# Altium schematic sheet Power.SchDoc
size A4; SheetNumber: 3; SheetTotal: 7
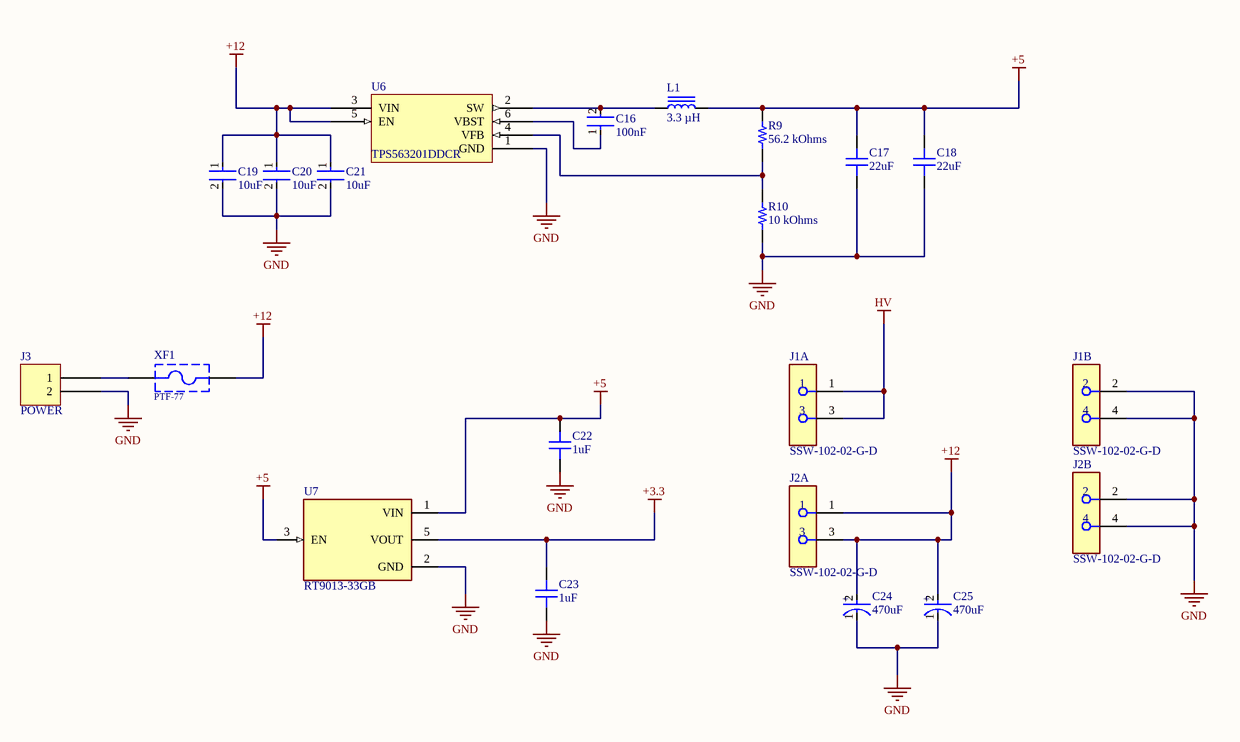
[diagram p0: Power.SchDoc]

## Parts
C16  100nF  [FP-C1005-050-0_15-MFG]
C17  22uF  [CAP 0603_1608]
C18  22uF  [CAP 0603_1608]
C19  10uF  [FP-CL21-IPC_B]
C20  10uF  [FP-CL21-IPC_B]
C21  10uF  [FP-CL21-IPC_B]
C22  1uF  [CAP 0603_1608]
C23  1uF  [CAP 0603_1608]
C24  470uF  [FP-RAD-TH-D_8_0_5-L_15_1-MFG]
C25  470uF  [FP-RAD-TH-D_8_0_5-L_15_1-MFG]
J1  SSW-102-02-G-D  [FP-SSW-102-02-G-D-MFG]  (parts A,B of 2)
J2  SSW-102-02-G-D  [FP-SSW-102-02-G-D-MFG]  (parts A,B of 2)
J3  POWER  [MOLEX KK 0022272021]
L1  3.3 µH  [BOURNS SRP5030T]
R9  56.2 kOhms  [RES 0402_1005]
R10  10 kOhms  [RES 0402_1005]
U6  TPS563201DDCR  [SOT23-6_M]
U7  RT9013-33GB  [RT9013]
XF1  PTF-77  [696107003002]

## Nets
+3.3: C23.2 U7.5(VOUT)
+5: C17.2 C18.2 C22.2 L1.2 R9.2 U7.1(VIN) U7.3(EN)
+12: C19.1 C20.1 C21.1 C24.2(A) C25.2(A) J2.1 J2.3 U6.3(VIN) U6.5(EN) XF1.2
GND: C17.1 C18.1 C19.2 C20.2 C21.2 C22.1 C23.1 C24.1(C) C25.1(C) J1.2 J1.4 J2.2 J2.4 J3.2 R10.1 U6.1(GND) U7.2(GND)
HV: J1.1 J1.3
NetC16_1: C16.1 U6.6(VBST)
NetC16_2: C16.2 L1.1 U6.2(SW)
NetJ3_1: J3.1 XF1.1
NetR9_1: R9.1 R10.2 U6.4(VFB)

## Notes on the sheet
- (in symbol CMP-05427-000701-1) +

## Library data of the parts
C16 = CMP-2000-05438-2: CAP CER 100nF 10V X5R 0402; Dielectric Material: Ceramic; Tolerance: 20%; Capacitance: 4.7uF; RoHS Compliant: Yes; Lead Free: Lead Free; Max Operating Temperature: 85°C; Case Code (Metric): 1005; Dielectric: X5R; Height: 0.5mm; Length: 1mm; Case Code (Imperial): 0402; Width: 0.02inch; Mount: Surface Mount; Case/Package: 0402; Min Operating Temperature: -55°C; Radiation Hardening: No; Resistor Type: Ceramic; Construction: Flat; REACH SVHC: No SVHC; Voltage Rating (DC): 10V; Voltage Rating: 10V; Package Quantity: 1; Termination: SMD/SMT; Thickness: 500um; Voltage: 10V; Packaging: Tape and Reel; Depth: 0.5mm; Weight: 2.3E-05oz; Series: C
C17 C18 C22 C23 = C0603C272F3GAC7867: CL10A226MP8NUNE; manufacturer: KEMET; Temperature Coefficient: C0G, NP0; Tolerance: ±1%; Voltage - Rated: 25V; Part Number: C0603C272F3GAC7867; Applications: General Purpose; componentlink1description: Datasheet; componentlink1url: https://api.kemet.com/component-edge/download/datasheet/C0603C272F3GACTU.pdf; componentlink2description: DigiKey Link; componentlink2url: https://www.digikey.com/en/products/detail/kemet/C0603C272F3GAC7867/2200413; Device Package: 0603 (1608 Metric); Features: Low ESL; lastupdated: 22.03.2023 19:09:03; Lifecycle Status: Active; Minimum Order: 1; Mounting Type: Surface Mount, MLCC; Operating Temperature: -55°C ~ 125°C; Package / Case: 0603 (1608 Metric); packaging: TapeAndReel; partid: 2138; Part Status: Active; price: 0.42; series: SMD Comm C0G; Size / Dimension: 0.063" L x 0.031" W (1.60mm x 0.80mm); Supplier 1: DigiKey; Supplier Part Number 1: 399-17403-1-ND; Thickness (Max): 0.034" (0.87mm)
  C17 C18: Value: 22uF; Capacitance: 22uF
  C22 C23: Value: 1uF; Capacitance: 1uF
C19-C21 = CMP-2000-06102-2: CL21 Series 0805 10uF 16V ±10% Tolerance X5R Multilayer Ceramic Chip Capacitor; Dielectric: X7R; Length: 2mm; Depth: 1.25mm; Voltage: 16V; Width: 0.049inch; Capacitance: 10uF; Lead Free: Lead Free; Max Operating Temperature: 85°C; Mount: Surface Mount; Voltage Rating: 16V; Height: 1.25mm; Radiation Hardening: No; Packaging: Tape and Reel; Voltage Rating (DC): 16V; Thickness: 0.055inch; Case/Package: 0805; Case Code (Imperial): 0805; Min Operating Temperature: -55°C; Case Code (Metric): 2012; Package Quantity: 1; Tolerance: 10%
C24 C25 = CMP-05427-000701-1: EEUFM1C471L; Ripple Current: 1.14A; Lead Diameter: 0.6mm; Voltage Rating: 50V; Polarity: Polar; ESR (Equivalent Series Resistance): 45mR; Life (Hours): 8000Hour; Tolerance: 20%; RoHS Compliant: Yes; Min Operating Temperature: -40°C; Diameter: 8mm; Package Quantity: 1; Capacitance: 470uF; Packaging: Tape and Reel; Mount: Through Hole; Lead Free: Lead Free; Lead Pitch: 5mm; Height - Seated (Max): 0.65inch; Radiation Hardening: No; Features: General Purpose; Length: 15mm; Height: 15mm; Case/Package: Radial; REACH SVHC: Yes; Voltage Rating (DC): 50V; Max Operating Temperature: 105°C; Termination: Radial; Weight: 0.102365oz; Series: FR; Impedance: 45mR
J1 J2 = CMP-02766-000581-1: CONN RCPT 4POS 0.1 GOLD PCB; Connector Type: Receptacle; Mating Cycles: 100; Pitch: 2.54mm; Voltage Rating: 550V; Row Spacing: 0.1inch; Number of Positions: 4; Current Rating: 6.9A; Radiation Hardening: No; Color: Black; Number of Rows: 2; Contact Plating: Gold; REACH SVHC: No SVHC; Housing Material: Plastic; Housing Color: Black; Mount: Through Hole; Orientation: Straight; Packaging: Bulk; Lead Free: Lead Free; Gender: Receptacle; Contact Material: Bronze; Termination: Solder; Number of Contacts: 4
J3 = 0022272021: CONN HEADER VERT 2POS 2.54MM; Manufacturer: Molex; Contact Length - Mating: 0.295" (7.49mm); Contact Length - Post: 0.140" (3.56mm); Material Flammability Rating: UL94 V-0; Number of Positions: 2; Number of Positions Loaded: All; Overall Contact Length: 0.560" (14.22mm); Pitch - Mating: 0.100" (2.54mm); Shrouding: Shrouded - 1 Wall; Style: Board to Cable/Wire; Part Number: 0022272021; ComponentLink1Description: Datasheet; ComponentLink1URL: https://www.molex.com/pdm_docs/sd/022272021_sd.pdf; ComponentLink2Description: DigiKey Link; ComponentLink2URL: http://digikey.com/product-detail/en/molex/0022272021/WM4111-ND/1130577; Connector Type: Header; Contact Finish - Mating: Tin; Contact Finish - Post: Tin; Contact Finish Thickness - Mating: 100.0µin (2.54µm); Contact Material: Brass; Contact Shape: Square; Contact Type: Male Pin; Fastening Type: Friction Lock; Insulation Color: Natural; Insulation Height: 0.461" (11.70mm); Insulation Material: Polyamide (PA), Nylon; LastUpdated: 12.01.2020 23:51:43; Lifecycle Status: Active; Minimum Order: 1; Mounting Type: Through Hole; Number of Rows: 1; Packaging: Bulk; PartId: 76; Part Status: Active; Price: 0.27; Series: KK 6410; Supplier 1: DigiKey; Supplier Part Number 1: WM4111-ND; Termination: Solder
L1 = SRP5030T-4R7M: MDA5030-3R3M; Manufacturer: Bourns Inc.; Current Rating (Amps): 4.6 A; Current - Saturation: 6A; DC Resistance (DCR): 53mOhm Max; Inductance: 4.7 µH; Inductance Frequency - Test: 100 kHz; Material - Core: Iron Powder; Shielding: Shielded; Tolerance: ±20%; Type: Drum Core, Wirewound; Part Number: SRP5030T-4R7M; ComponentLink1Description: Datasheet; ComponentLink1URL: https://www.bourns.com/docs/Product-Datasheets/SRP5030T.pdf; ComponentLink2Description: DigiKey Link; ComponentLink2URL: https://www.digikey.com/en/products/detail/bourns-inc/SRP5030T-4R7M/3986084; Device Package: Nonstandard; Height - Seated (Max): 0.118" (3.00mm); LastUpdated: 22.03.2023 20:00:38; Lifecycle Status: Active; Minimum Order: 1; Mounting Type: Surface Mount; Operating Temperature: -40°C ~ 125°C; Package / Case: Nonstandard; Packaging: TapeAndReel; PartId: 1; Part Status: Active; Price: 0.61; Series: SRP5030T; Size / Dimension: 0.224" L x 0.205" W (5.70mm x 5.20mm); Supplier 1: DigiKey; Supplier Part Number 1: SRP5030T-4R7MCT-ND; Value: 3.3 µH
R9 R10 = RC0402FR-07110KL: RES 110K OHM 1% 1/16W 0402; Manufacturer: Yageo; Power (Watts): 0.063W, 1/16W; Temperature Coefficient: ±100ppm/°C; Part Number: RC0402FR-07110KL; ComponentLink1Description: Datasheet; ComponentLink1URL: https://www.yageo.com/upload/media/product/productsearch/datasheet/rchip/PYu-RC_Group_51_RoHS_L_10.pdf; ComponentLink2Description: DigiKey Link; ComponentLink2URL: https://www.digikey.com/en/products/detail/yageo/RC0402FR-07110KL/726531; Composition: Thick Film; Device Package: 0402 (1005 Metric); Features: Moisture Resistant; Height - Seated (Max): 0.016" (0.40mm); LastUpdated: 22.03.2023 19:23:12; Lifecycle Status: Active; Minimum Order: 1; Number of Terminations: 2; Operating Temperature: -55°C ~ 155°C; Package / Case: 0402 (1005 Metric); Packaging: CutTape; PartId: 2713; Part Status: Active; Price: 0.01; Series: RC_L; Size / Dimension: 0.039" L x 0.020" W (1.00mm x 0.50mm); Supplier 1: DigiKey; Supplier Part Number 1: 311-110KLRCT-ND; Supplier Device Package: 0402; Tolerance: ±1%
  R9: Value: 56.2 kOhms; Resistance: 56.2 kOhms
  R10: Value: 10 kOhms; Resistance: 10 kOhms
U7 = RT9013-33GB: Linear Voltage Regulator IC 1 Output 500mA SOT-23-5; MF: Richtek USA; Availability: Unavailable; Price: None; SnapEDA_Link: https://www.snapeda.com/parts/RT9013-33GB/Richtek%20USA%20Inc./view-part/553199/?ref=snap; Value: *; MP: RT9013-33GB; Package: SOT-23-5 Richtek
XF1 = CMP-1502-00236-1: Manufacturer: Wurth Elektronik; Fuse Size: 5x20mm; Mounting Technology: THT; Part Number: 696107003002; Package Reference: 696107003002; Publisher: WurthElektronik; Datasheet URL: https://katalog.we-online.de/em/datasheet/696107003002.pdf; Manufacturer URL: http://www.we-online.de; Operating Temperature: -30to120degC; Packaging: Box